# EAGLE design protomega (EAGLE 6.1)
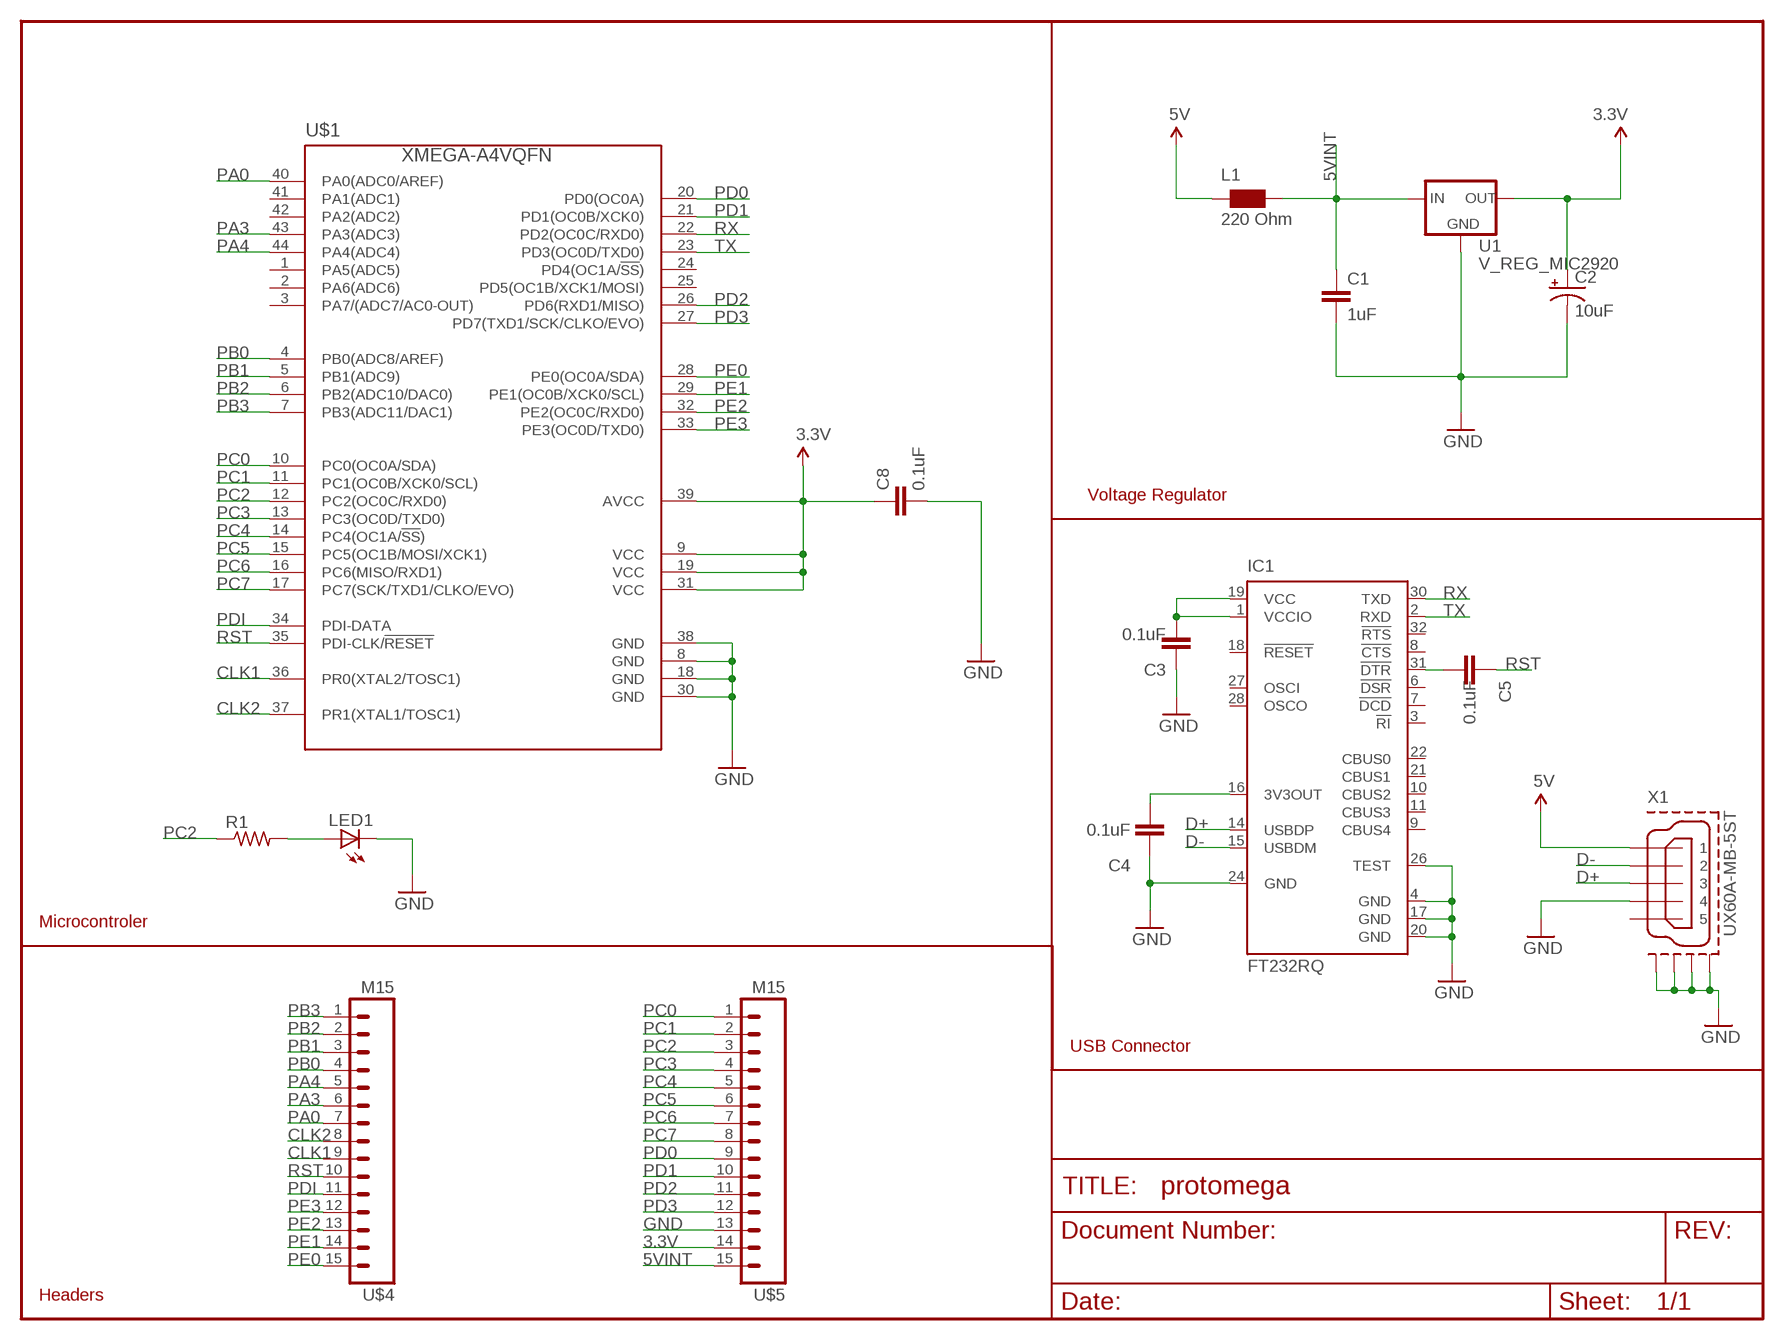
[diagram p0: schematic, sheet 1]

## Parts
C1  1uF  C-EUC0603  [C0603]
C2  10uF  CAP_POL1206  [EIA3216]
C3  0.1uF  C-EUC0603  [C0603]
C4  0.1uF  C-EUC0603  [C0603]
C5  0.1uF  C-EUC0603  [C0603]
C8  0.1uF  C-EUC0603  [C0603]
IC1  FT232RQ  [QFN32]
L1  220 Ohm  WE-CBF_0603  [0603]
LED1  LEDSMT1206  [1206]
R1  R-US_R0603  [R0603]
U1  V_REG_MIC2920  [SOT223]
U$1  XMEGA-A4VQFN  [QFN44]
U$4  M15  [1X15]
U$5  M15  [1X15]
X1  UX60A-MB-5ST  MINI-USB-SHIELD-UX60A-MB-5ST  [UX60A-MB-5ST]

## Nets
3.3V: C2.A(+) C8.1 U1.3(OUT) U$1.9(VCC) U$1.19(VCC) U$1.31(VCC) U$1.39(AVCC) U$5.14
5V: L1.1 X1.1
5VINT: C1.1 L1.2 U1.1(IN) U$5.15
CLK1: U$1.36(PR0(XTAL2/TOSC1)) U$4.9
CLK2: U$1.37(PR1(XTAL1/TOSC1)) U$4.8
D+: IC1.14(USBDP) X1.3
D-: IC1.15(USBDM) X1.2
GND: C1.2 C2.C(-) C3.1 C4.1 C8.2 IC1.4(GND) IC1.17(GND) IC1.20(GND) IC1.24(GND) IC1.26(TEST) LED1.C U1.2(GND) U$1.8(GND) U$1.18(GND) U$1.30(GND) U$1.38(GND) U$5.13 X1.4 X1.M1(GND1) X1.M2(GND2) X1.M3(GND3) X1.M4(GND4)
N$1: C3.2 IC1.1(VCCIO) IC1.19(VCC)
N$2: LED1.A R1.2
N$3: C4.2 IC1.16(3V3OUT)
N$7: C5.2 IC1.31(!DTR)
PA0: U$1.40(PA0(ADC0/AREF)) U$4.7
PA3: U$1.43(PA3(ADC3)) U$4.6
PA4: U$1.44(PA4(ADC4)) U$4.5
PB0: U$1.4(PB0(ADC8/AREF)) U$4.4
PB1: U$1.5(PB1(ADC9)) U$4.3
PB2: U$1.6(PB2(ADC10/DAC0)) U$4.2
PB3: U$1.7(PB3(ADC11/DAC1)) U$4.1
PC0: U$1.10(PC0(OC0A/SDA)) U$5.1
PC1: U$1.11(PC1(OC0B/XCK0/SCL)) U$5.2
PC2: R1.1 U$1.12(PC2(OC0C/RXD0)) U$5.3
PC3: U$1.13(PC3(OC0D/TXD0)) U$5.4
PC4: U$1.14(PC4(OC1A/!SS!)) U$5.5
PC5: U$1.15(PC5(OC1B/MOSI/XCK1)) U$5.6
PC6: U$1.16(PC6(MISO/RXD1)) U$5.7
PC7: U$1.17(PC7(SCK/TXD1/CLKO/EVO)) U$5.8
PD0: U$1.20(PD0(OC0A)) U$5.9
PD1: U$1.21(PD1(OC0B/XCK0)) U$5.10
PD2: U$1.26(PD6(RXD1/MISO)) U$5.11
PD3: U$1.27(PD7(TXD1/SCK/CLKO/EVO)) U$5.12
PDI: U$1.34(PDI-DATA) U$4.11
PE0: U$1.28(PE0(OC0A/SDA)) U$4.15
PE1: U$1.29(PE1(OC0B/XCK0/SCL)) U$4.14
PE2: U$1.32(PE2(OC0C/RXD0)) U$4.13
PE3: U$1.33(PE3(OC0D/TXD0)) U$4.12
RST: C5.1 U$1.35(PDI-CLK/!RESET) U$4.10
RX: IC1.30(TXD) U$1.22(PD2(OC0C/RXD0))
TX: IC1.2(RXD) U$1.23(PD3(OC0D/TXD0))
Unconnected: IC1.3(!RI) IC1.6(!DSR) IC1.7(!DCD) IC1.8(!CTS) IC1.9(CBUS4) IC1.10(CBUS2) IC1.11(CBUS3) IC1.18(!RESET) IC1.21(CBUS1) IC1.22(CBUS0) IC1.27(OSCI) IC1.28(OSCO) IC1.32(!RTS) U$1.1(PA5(ADC5)) U$1.2(PA6(ADC6)) U$1.3(PA7/(ADC7/AC0-OUT)) U$1.24(PD4(OC1A/!SS!)) U$1.25(PD5(OC1B/XCK1/MOSI)) U$1.41(PA1(ADC1)) U$1.42(PA2(ADC2)) X1.5

## Notes on the sheet
- Voltage Regulator
- Microcontroler
- USB Connector
- Headers

## Library data of the parts
C1 C3-C5 C8 = rcl:C-EU: CAPACITOR, European symbol
C2 = sparkfun:CAP_POL: Capacitor Polarized These are standard SMD and PTH capacitors. Normally 10uF, 47uF, and 100uF in electrolytic and tantalum varieties. Always verify the external diameter of the through hole cap, it varies with capacity, voltage, and manufacturer. The EIA devices should be standard.
IC1 = ftdichip:FT232R: Source: http://www.ftdichip.com/Documents/DataSheets/DS_FT232R_v104.pdf; MPN: FT232RQ; OC_FARNELL: 1146033; OC_NEWARK: 91K9919
L1 = wuerth-elektronik:WE-CBF: SMD EMI Suppression Ferrite Beads - excellent anti-EMI properties - low DCR - impedances till 3000 ohms - rated current up to 6 A
LED1 = adafruit:LED: LED OSRAM: - CHIPLED LG R971, LG N971, LY N971, LG Q971, LY Q971, LO R971, LY R971 LH N974, LH R974 LS Q976, LO Q976, LY Q976 LO Q996 - Hyper CHIPLED LW Q18S LB Q993, LB Q99A, LB R99A - SideLED LS A670, LO A670, LY A670, LG A670, LP A670 LB A673, LV A673, LT A673, LW A673 LH A674 LY A675 LS A676, LA A676, LO A676, LY A676, LW A676 LS A679, LY A679, LG A679 - Hyper Micro SIDELED® LS Y876, LA Y876, LO Y876, LY Y876 LT Y87S - SmartLED LW L88C, LW L88S LB L89C, LB L89S, LG L890 LS L89K, LO L89K, LY L89K LS L896, LA L896, LO L896, LY L896 - TOPLED LS T670, LO T670, LY T670, LG T670, LP T670 LSG T670, LSP T670, LSY T670, LOP T670, LYG T670 LG T671, LOG T671, LSG T671 LB T673, LV T673, LT T673, LW T673 LH T674 LS T676, LA T676, LO T676, LY T676, LB T676, LH T676, LSB T676, LW T676 LB T67C, LV T67C, LT T67C, LS T67K, LO T67K, LY T67K, LW E67C LS E67B, LA E67B, LO E67B, LY E67B, LB E67C, LV E67C, LT E67C LW T67C LS T679, LY T679, LG T679 LS T770, LO T770, LY T770, LG T770, LP T770 LB T773, LV T773, LT T773, LW T773 LH T774 LS E675, LA E675, LY E675, LS T675 LS T776, LA T776, LO T776, LY T776, LB T776 LHGB T686 LT T68C, LB T68C - Hyper Mini TOPLED® LB M676 - Mini TOPLED Santana® LG M470 LS M47K, LO M47K, LY M47K Source: http://www.osram.convergy.de/
R1 = adafruit:R-US_: RESISTOR, American symbol
U1 = sparkfun:V_REG_MIC2920: MIC2920A (http://www.micrel.com/_PDF/mic2920.pdf) - 400mA output LDO Regulator
U$1 = custom:XMEGA-A4: Atmel XMega A4 series processor
U$4 U$5 = sparkfun:M15: Header 15 Standard 15-pin 0.1" header. Use with straight break away headers (SKU : PRT-00116), right angle break away headers (PRT-00553), swiss pins (PRT-00743), machine pins (PRT-00117), and female headers (PRT-00115).
X1 = usb_con-update:MINI-USB-SHIELD-: MINI USB Connector Source: http://www.hirose.co.jp/cataloge_hp/e24000019.pdf

## Board
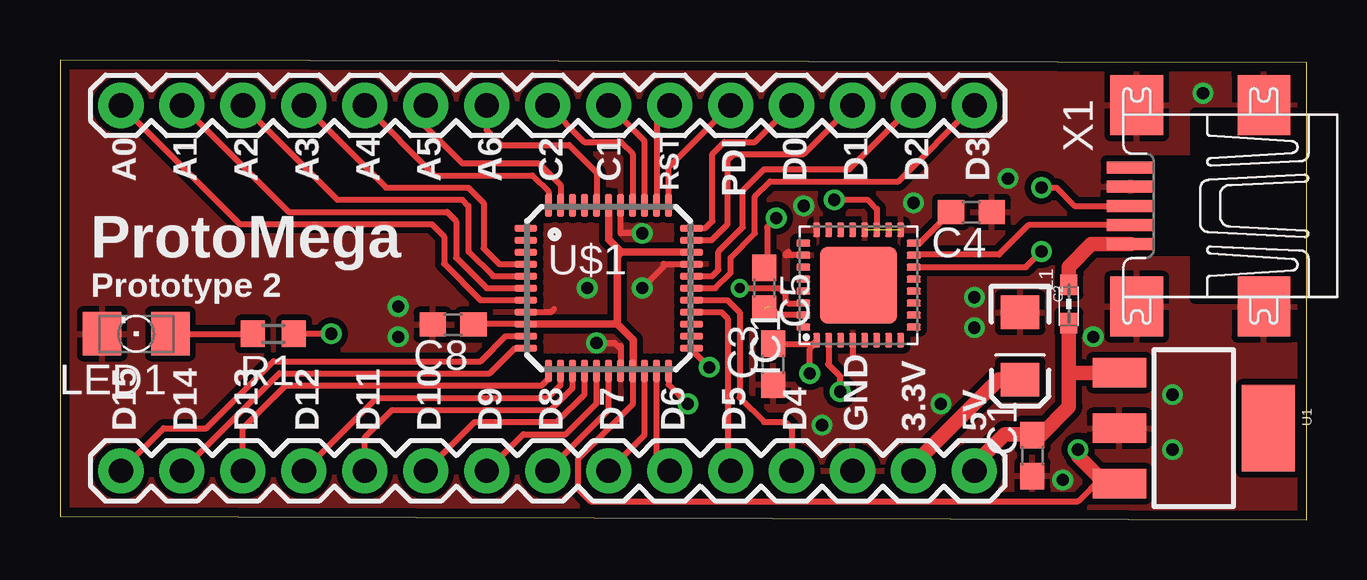
[diagram p1: board, top side]
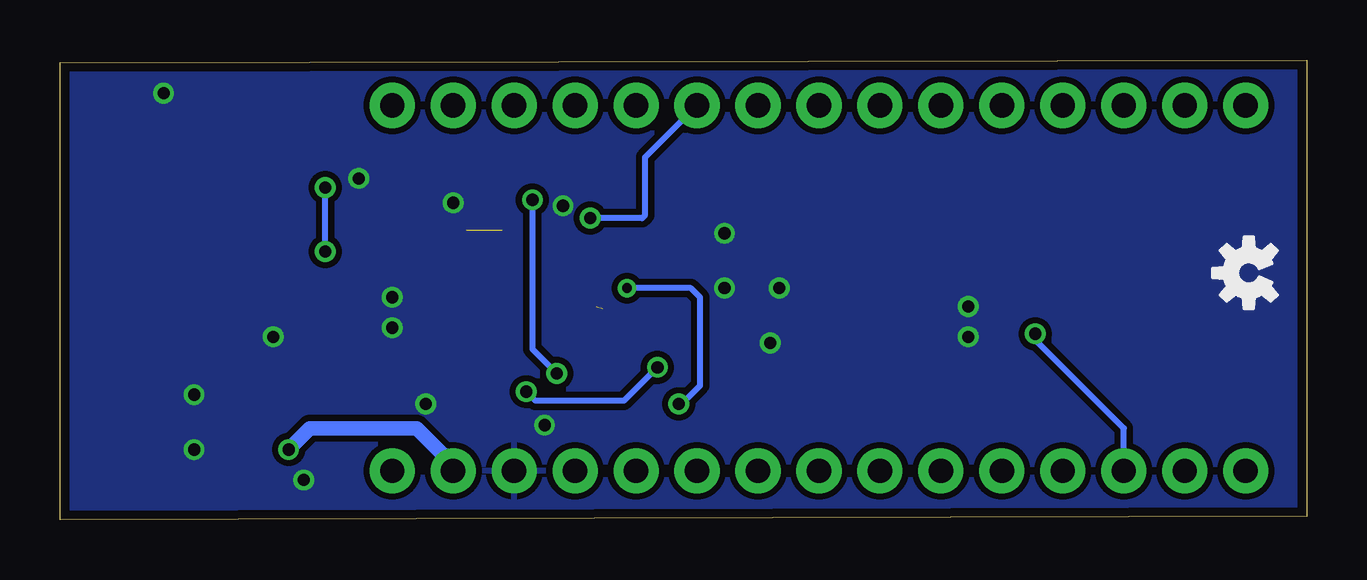
[diagram p2: board, bottom side, seen from below]

Size 51.94 x 19.17 mm. Coordinates in mm from the lower left corner, seen from the top.
Outline: 0,0.13 51.94,0 51.94,19.05 0,19.17 0,0.13
Copper layers (1*16): Top 0.0356mm / dielectric 1.5011mm / Bottom 0.0356mm
Design rules: minimum track width 6mil, minimum drill 13mil, track to track 6mil, track to pad 6mil, pad to pad 6mil, via to via 6mil, smd to smd 6mil, copper to edge 15mil, drill to drill 6mil, minimum pad ring 7mil, minimum via ring 7mil, stop-mask expansion 2mil, vias tented up to drill 20mil, thermal gap 10mil

### Footprints (pad centres in the part's own frame; a part is rotated, then mirrored left to right if it is on the bottom)
C0603 = smd 1.1 x 1: 1 -0.85,0; 2 0.85,0
EIA3216 = smd 1.4 x 1.6: A 1.4,0; C -1.4,0
QFN32 = smd 0.6 x 0.3: 1 -2.3,1.75; 2 -2.3,1.25; 3 -2.3,0.75; 4 -2.3,0.25; 5 -2.3,-0.25; 6 -2.3,-0.75; 7 -2.3,-1.25; 8 -2.3,-1.75; 17 2.3,-1.75; 18 2.3,-1.25; 19 2.3,-0.75; 20 2.3,-0.25; 21 2.3,0.25; 22 2.3,0.75; 23 2.3,1.25; 24 2.3,1.75 | smd 0.3 x 0.6: 9 -1.75,-2.3; 10 -1.25,-2.3; 11 -0.75,-2.3; 12 -0.25,-2.3; 13 0.25,-2.3; 14 0.75,-2.3; 15 1.25,-2.3; 16 1.75,-2.3; 25 1.75,2.3; 26 1.25,2.3; 27 0.75,2.3; 28 0.25,2.3; 29 -0.25,2.3; 30 -0.75,2.3; 31 -1.25,2.3; 32 -1.75,2.3 | smd 3.2 x 3.2: EXP 0,0
0603 = smd 0.85 x 0.7: 1 -0.9,0; 2 0.7,0
1206 = smd 1.6 x 1.803: A -1.422,0; C 1.422,0
R0603 = smd 1 x 1.1: 1 -0.85,0; 2 0.85,0
SOT223 = smd 1.219 x 2.235: 1 -2.311,-3.099; 2 0,-3.099; 3 2.311,-3.099 | smd 3.6 x 2.2: 4 0,3.099
QFN44 = smd 0.954 x 0.3: 1 -3.452,2.5; 2 -3.452,2; 3 -3.452,1.5; 4 -3.452,1; 5 -3.452,0.5; 6 -3.452,0; 7 -3.452,-0.5; 8 -3.452,-1; 9 -3.452,-1.5; 10 -3.452,-2; 11 -3.452,-2.5; 23 3.452,-2.5; 24 3.452,-2; 25 3.452,-1.5; 26 3.452,-1; 27 3.452,-0.5; 28 3.452,0; 29 3.452,0.5; 30 3.452,1; 31 3.452,1.5; 32 3.452,2; 33 3.452,2.5 | smd 0.3 x 0.954: 12 -2.5,-3.452; 13 -2,-3.452; 14 -1.5,-3.452; 15 -1,-3.452; 16 -0.5,-3.452; 17 0,-3.452; 18 0.5,-3.452; 19 1,-3.452; 20 1.5,-3.452; 21 2,-3.452; 22 2.5,-3.452; 34 2.5,3.452; 35 2,3.452; 36 1.5,3.452; 37 1,3.452; 38 0.5,3.452; 39 0,3.452; 40 -0.5,3.452; 41 -1,3.452; 42 -1.5,3.452; 43 -2,3.452; 44 -2.5,3.452
1X15 = drill 1.016 pad 1.88: 1 0,0; 2 2.54,0; 3 5.08,0; 4 7.62,0; 5 10.16,0; 6 12.7,0; 7 15.24,0; 8 17.78,0; 9 20.32,0; 10 22.86,0; 11 25.4,0; 12 27.94,0; 13 30.48,0; 14 33.02,0; 15 35.56,0
UX60A-MB-5ST = smd 2 x 0.5: 1 2.25,1.6; 2 2.25,0.8; 3 2.25,0; 4 2.25,-0.8; 5 2.25,-1.6 | smd 2.2 x 2.5: M1 -3.3,-4.2; M2 -3.3,4.2; M3 2,4.2; M4 2,-4.2

### Placement (x,y rotation side)
C1  40.51,2.67 270 top
C2  40.01,7.24 270 top
C3  29.72,6.48 90 top
C4  37.97,12.83 180 top
C5  29.34,9.65 270 top
C8  16.38,8.13 180 top
IC1  33.27,9.78 90 top
L1  42.04,8.89 270 top
LED1  3.17,7.75 180 top
R1  8.89,7.75 180 top
U1  47.24,3.81 270 top
U$1  22.86,9.65 0 top
U$4  2.54,17.27 0 top
U$5  2.54,2.03 0 top
U$6  [OSHW-LOGO-S]  2.41,10.29 90 bottom
X1  46.86,13.08 180 top

### Tracks (layer width: path | path; a pad name or v marks a point on that pad's centre or on a via)
3.3V  (via drill 0.51)
  Top 0.254: 23.88,6.34 U$1.19 23.86,6.24 23.88,6.22 23.88,4.83 21.59,2.54 21.59,1.27 22.1,0.76 42.42,0.76 43.43,1.78 43.43,1.75 | 43.31,1.75 43.43,1.75 | 43.43,1.75 U1.3 | U$1.9 17.26,8.15 C8.1
  Top 0.305: 23.22,8.15 U$1.9 | 23.22,8.15 23.88,7.49 23.88,6.34 | 23.39,11.15 U$1.31 | 23.39,11.15 22.86,11.68 U$1.39 | 23.22,8.15 23.22,10.98 23.39,11.15
  Top 0.61: v42.42,2.92 42.42,2.64 43.31,1.75 | C2.A 39.11,5.84 35.56,2.29 U$5.14
  Bottom 0.61: U$5.14 35.56,2.29 37.08,3.81 41.53,3.81 v42.42,2.92
5V
  Top 0.61: X1.1 42.98,11.48 42.04,10.54 L1.1
5VINT
  Top 0.61: 42.04,6.1 42.04,4.7 40.85,3.52 C1.1 40.73,3.56 39.37,3.56 38.1,2.29 U$5.15 | 42.04,6.1 L1.2 | U1.1 42.06,6.12 42.04,6.1
CLK1
  Top 0.254: U$1.36 24.36,15.77 U$4.9
CLK2
  Top 0.254: U$1.37 23.86,15.26 23.37,15.75 21.84,15.75 U$4.8
D+  (via drill 0.51)
  Top 0.254: IC1.14 40.25,10.53 v40.89,11.18 | v40.89,13.84 41.53,13.84 42.29,13.08 X1.3
  Bottom 0.254: v40.89,11.18 v40.89,13.84
D-
  Top 0.254: X1.2 40.35,12.28 39.12,11.05 35.56,11.05 IC1.15
GND  (via drill 0.51)  (1 unrouted)
  Top 0.254: U$1.8 20.46,8.65 20.57,8.76 | U$1.38 23.36,11.95 23.37,11.94 v24.26,11.94 | 25.16,10.65 U$1.30 | 25.16,10.65 25.15,10.67 | 23.36,7.11 U$1.18 | 23.36,7.11 23.36,7.23 23.37,7.24 23.37,7.11 | 25.16,10.65 25.16,10.56 v24.26,9.65 | v22.35,7.37 23.11,7.37 23.36,7.11 | IC1.4 33.02,6.73 | IC1.26 30.25,11.03 30.23,11.05 30.35,11.18
  other vias: 21.97,9.65 46.35,5.21 46.35,2.92 38.1,8 47.62,17.78 43.05,7.62 36.7,4.83 41.78,1.65 14.1,8.89 14.1,7.62 30.99,13.08 35.56,13.21 31.75,3.94 38.1,9.27 39.5,14.22
  pour Top (isolate 0.254): 0,19.18 51.94,19.05 51.94,0 0,0.13
  pour Bottom (isolate 0.254): 0,19.18 51.94,19.05 51.94,0 0,0.13
N$1  (via drill 0.51)
  Top 0.254: C3.2 31.37,7.33 IC1.1 31.52,7.39 31.24,7.11 v31.24,6.1 | v32.26,13.34 33.66,13.34 34.04,12.95 34.04,12.09 IC1.19
  Bottom 0.254: v32.26,13.34 32.26,7.11 v31.24,6.1
N$2
  Top 0.254: LED1.A R1.2
N$3
  Top 0.254: IC1.16 35.83,11.53 C4.2
N$7  (1 unrouted)
  Top 0.254: IC1.31 29.95,8.53 29.59,8.89
PA0
  Top 0.254: U$4.7 17.78,16.26 18.41,15.62 21.21,15.62 22.36,14.47 U$1.40
PA3
  Top 0.254: U$4.6 15.24,16.38 16.76,14.86 19.94,14.86 20.86,13.94 U$1.43
PA4
  Top 0.254: U$1.44 20.36,13.68 19.68,14.35 15.62,14.35 U$4.5
PB0
  Top 0.254: U$1.4 18.3,10.65 17.65,11.3 17.65,13.21 17.02,13.84 13.59,13.84 U$4.4
PB1
  Top 0.254: U$1.5 18.04,10.15 17.02,11.18 17.02,13.08 16.76,13.34 11.56,13.34 U$4.3
PB2
  Top 0.254: U$1.6 17.78,9.65 16.51,10.92 16.51,12.45 16.13,12.83 9.53,12.83 U$4.2
PB3
  Top 0.254: U$1.7 17.52,9.15 16,10.67 16,11.81 15.49,12.32 7.49,12.32 U$4.1
PC0
  Top 0.254: U$1.10 18.57,7.65 17.53,6.6 8.89,6.6 6.1,3.81 4.32,3.81 U$5.1 2.79,2.29
PC1
  Top 0.254: U$1.11 18.96,7.15 17.91,6.1 9.14,6.1 U$5.2
PC2  (via drill 0.51)
  Top 0.254: U$1.12 20.36,5.88 20.07,5.59 9.4,5.59 7.62,3.81 U$5.3 | v11.3,7.75 R1.1
  Bottom 0.254: v11.3,7.75 11.3,7.49 7.62,3.81 U$5.3
PC3
  Top 0.254: U$5.4 13.21,5.08 20.32,5.08 20.86,5.62 U$1.13
PC4
  Top 0.254: U$1.14 21.36,5.48 20.45,4.57 13.84,4.57 12.7,3.43 U$5.5
PC5
  Top 0.254: U$1.15 21.86,5.22 20.7,4.06 17.27,4.06 U$5.6
PC6
  Top 0.254: U$1.16 22.36,4.83 21.08,3.56 19.3,3.56 U$5.7
PC7
  Top 0.254: U$1.17 22.86,4.57 U$5.8
PD0
  Top 0.254: U$1.20 24.36,3.53 U$5.9
PD1
  Top 0.254: U$1.21 24.86,2.57 U$5.10
PD2
  Top 0.254: U$1.26 27.54,8.65 27.81,8.38 27.81,2.16 U$5.11
PD3
  Top 0.254: 30.48,1.91 U$5.12 30.48,3.81 30.23,4.06 29.34,4.06 28.32,5.08 28.32,8.64 27.8,9.15 U$1.27
PDI
  Top 0.254: U$1.34 25.36,14.69 U$4.11
PE0
  Top 0.254: U$1.28 27.3,9.65 27.94,10.29 27.94,10.92 28.96,11.94 28.96,13.46 29.59,14.1 34.92,14.1 U$4.15
PE1
  Top 0.254: U$1.29 27.17,10.15 27.43,10.41 27.43,11.18 28.45,12.19 28.45,13.72 29.34,14.61 32.89,14.61 U$4.14
PE2
  Top 0.254: U$1.32 27.15,11.65 27.81,12.32 27.81,14.99 28.07,15.24 30.99,15.24 U$4.13
PE3
  Top 0.254: U$1.33 26.88,12.15 27.18,12.45 27.18,15.24 27.69,15.75 28.96,15.75 U$4.12
RST  (via drill 0.51)
  Top 0.254: U$1.35 24.86,16.73 U$4.10 | 29.3,10.54 29.34,10.54 29.46,10.67 29.46,12.19 v29.84,12.57 | 29.21,10.54 29.3,10.54 | 29.3,10.54 C5.1
  Bottom 0.254: U$4.10 27.56,15.11 27.56,12.7 27.69,12.57 v29.84,12.57
RX  (via drill 0.41, 0.51)
  Top 0.254: U$1.22 25.36,5.63 v26.16,4.83 | v28.32,9.65 29.97,9.65 30.23,9.4 30.23,9.14 30.35,9.02 IC1.30
  Bottom 0.254: v26.16,4.83 26.04,4.83 25.27,5.59 25.27,9.27 25.65,9.65 v28.32,9.65
TX  (via drill 0.51)
  Top 0.254: U$1.23 26.31,7.09 v27.05,6.35 | v32.51,5.33 32.51,5.97 32,6.48 32.02,6.5 IC1.2
  Bottom 0.254: v27.05,6.35 28.45,4.95 32.13,4.95 v32.51,5.33

### Text on the board
tPlace: A0 | A1 | A2 | A3 | A4 | A5 | A6 | C2 | C1 | RST | D0 | D1 | D2 | D3 | PDI | ProtoMega | Prototype 2 | D15 | D14 | D13 | D12 | D11 | D10 | D9 | D8 | D7 | D6 | D5 | D4 | GND | 3.3V | 5V